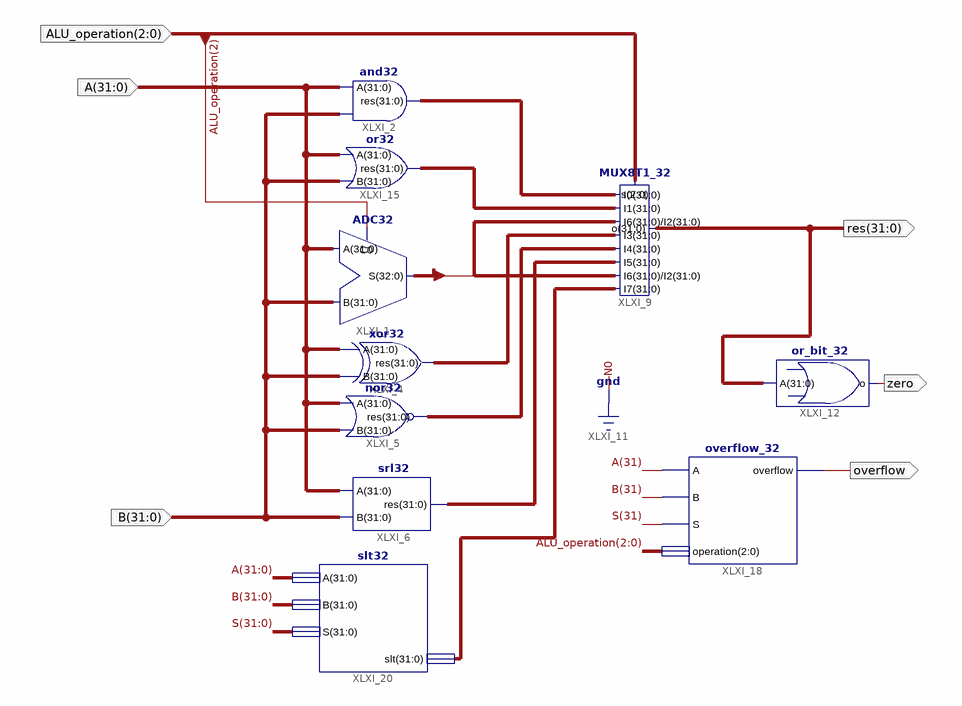
[diagram p0: schematic sheet 1]
// Xilinx ISE schematic ALU.sch (kintex7) as structural Verilog: 10 symbols, 6 ports
module ALU (
  input  [31:0] A,
  input  [2:0] ALU_operation,
  input  [31:0] B,
  output [31:0] res,
  output zero,
  output overflow
);

  wire [31:0] XLXN_14, XLXN_19, XLXN_20, XLXN_21, XLXN_40, XLXN_45;
  wire [32:0] S;

  ADC32 XLXI_1 (.B(B), .A(A), .C0(ALU_operation[2]), .S(S));
  and32 XLXI_2 (.res(XLXN_14), .A(A), .B(B));
  xor32 XLXI_4 (.A(A), .B(B), .res(XLXN_19));
  nor32 XLXI_5 (.res(XLXN_20), .A(A), .B(B));
  srl32 XLXI_6 (.A(A), .B(B), .res(XLXN_21));
  MUX8T1_32 XLXI_9 (
    .s(ALU_operation), .I7(XLXN_45), .I6(S[31:0]), .I5(XLXN_21), .I4(XLXN_20), .I3(XLXN_19), .I2(S[31:0]),
    .I1(XLXN_40), .I0(XLXN_14), .o(res));
  or_bit_32 XLXI_12 (.o(zero), .A(res));
  or32 XLXI_15 (.A(A), .B(B), .res(XLXN_40));
  overflow_32 XLXI_18 (.A(A[31]), .B(B[31]), .S(S[31]), .operation(ALU_operation), .overflow(overflow));
  slt32 XLXI_20 (.A(A), .B(B), .S(S[31:0]), .slt(XLXN_45));
endmodule
